# EAGLE design SparkFun_Differential_I2C_Breakout_PCA9615_Qwiic (EAGLE 7.7.0)
ABBREV: hb1; PROJECT: Heading Board
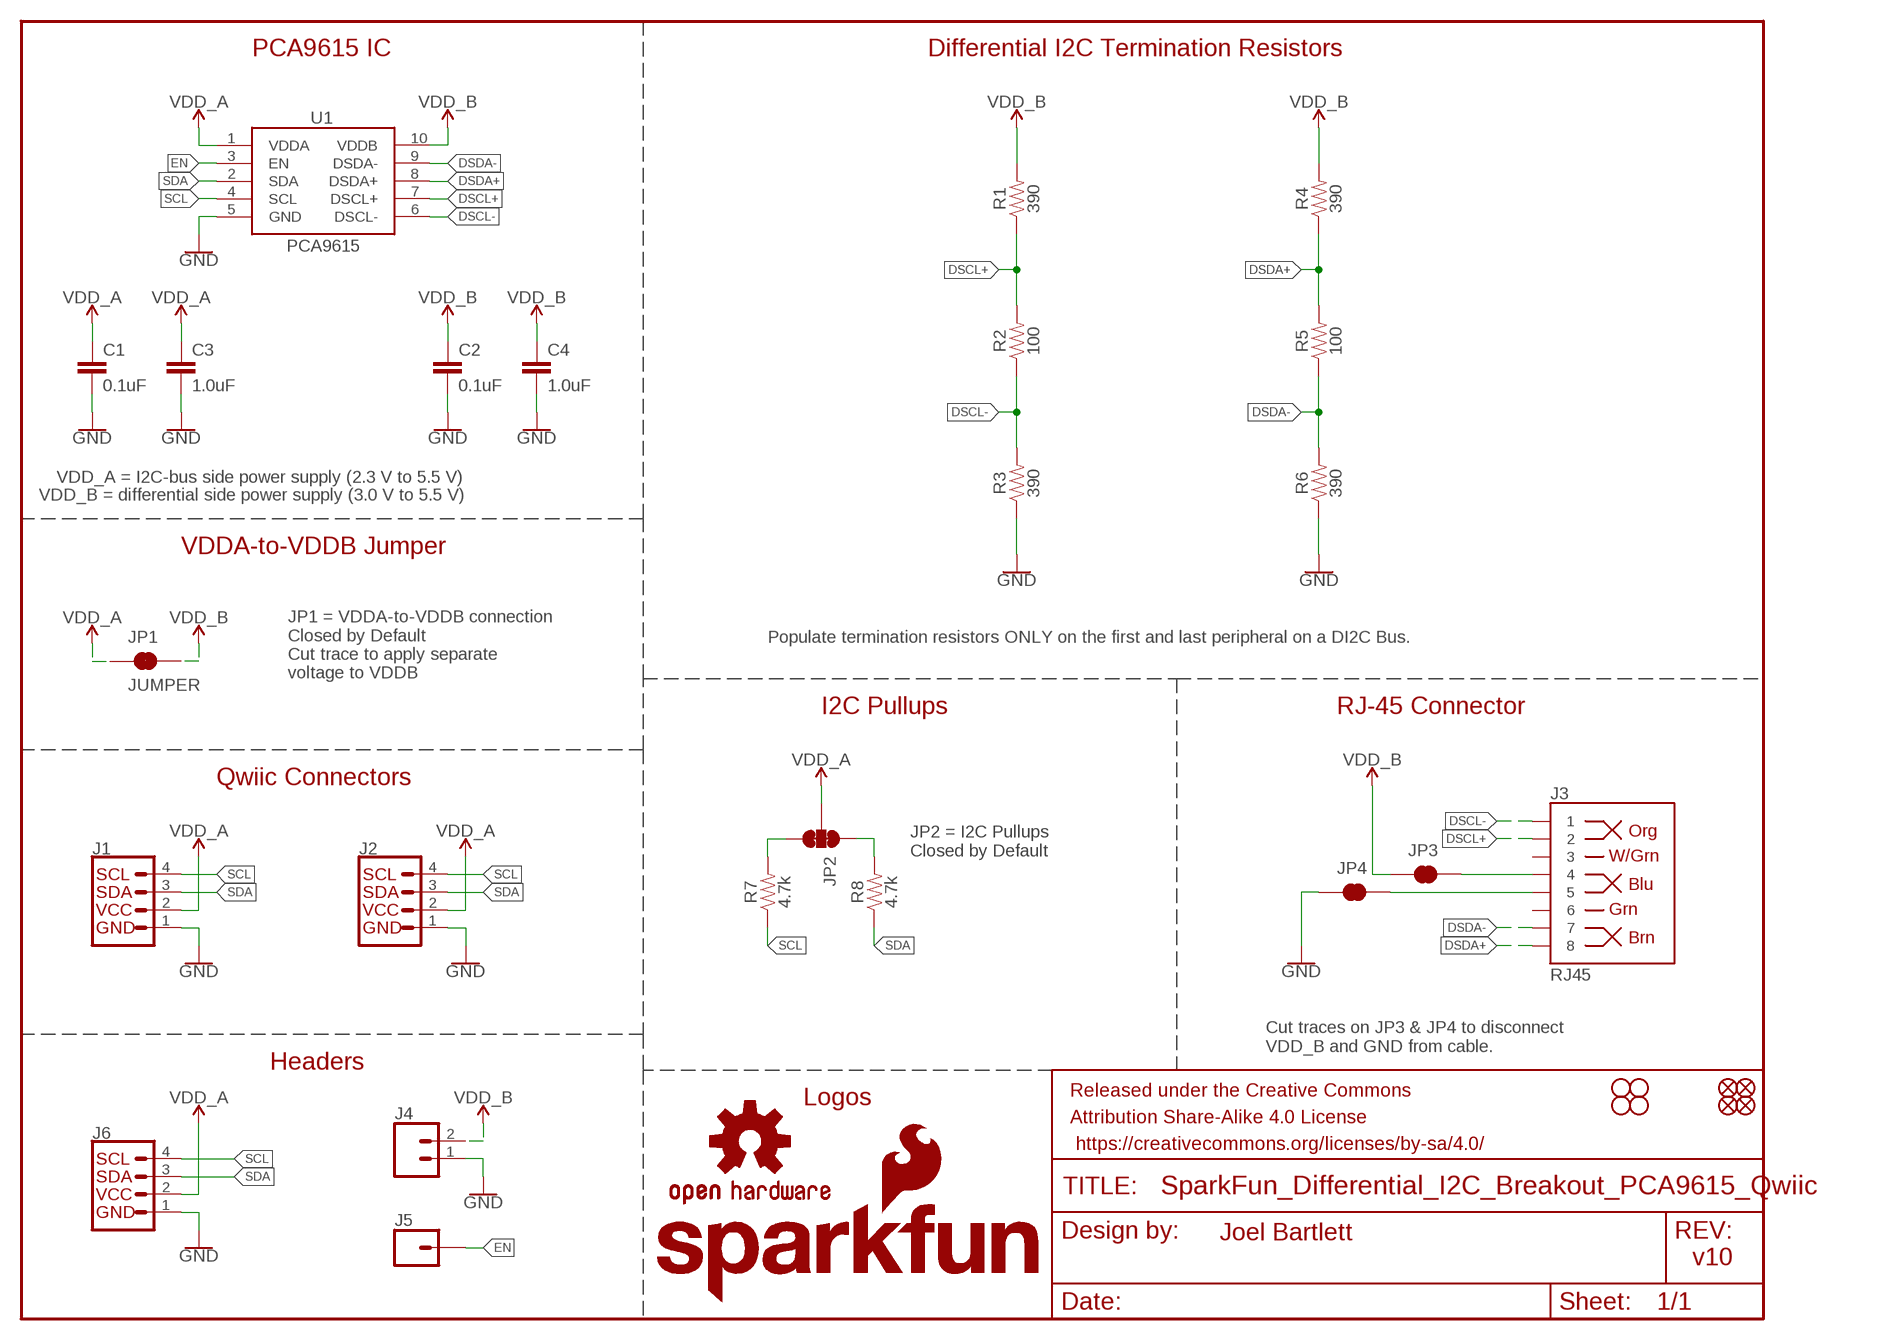
[diagram p0: schematic, sheet 1]

## Parts
C1  0.1uF  0.1UF-0603-25V-(+80/-20%)  [0603]
C2  0.1uF  0.1UF-0603-25V-(+80/-20%)  [0603]
C3  1.0uF  1.0UF-0603-16V-10%  [0603]
C4  1.0uF  1.0UF-0603-16V-10%  [0603]
FD1  FIDUCIALUFIDUCIAL  [FIDUCIAL-MICRO]
FD2  FIDUCIALUFIDUCIAL  [FIDUCIAL-MICRO]
FD3  FIDUCIALUFIDUCIAL  [FIDUCIAL-MICRO]
FD4  FIDUCIALUFIDUCIAL  [FIDUCIAL-MICRO]
FRAME1  FRAME-LETTER  [CREATIVE_COMMONS]
H1  STAND-OFF  [STAND-OFF]
H2  STAND-OFF  [STAND-OFF]
H3  STAND-OFF  [STAND-OFF]
H4  STAND-OFF  [STAND-OFF]
J1  QWIIC_CONNECTORJS-1MM  [1X04_1MM_RA]
J2  QWIIC_CONNECTORJS-1MM  [1X04_1MM_RA]
J3  RJ45  RJ45-8  [RJ45-8]
J4  CONN_021X02_NO_SILK  [1X02_NO_SILK]
J5  CONN_01PTH_NO_SILK_YES_STOP  [1X01_NO_SILK]
J6  I2C_STANDARD_NO_SILK  [1X04_NO_SILK]
JP1  JUMPER  JUMPER-SMT_2_NC_TRACE_SILK  [SMT-JUMPER_2_NC_TRACE_SILK]
JP2  JUMPER-SMT_3_2-NC_TRACE_SILK  [SMT-JUMPER_3_2-NC_TRACE_SILK]
JP3  JUMPER-SMT_2_NC_TRACE_SILK  [SMT-JUMPER_2_NC_TRACE_SILK]
JP4  JUMPER-SMT_2_NC_TRACE_SILK  [SMT-JUMPER_2_NC_TRACE_SILK]
LOGO1  OSHW-LOGOM  [OSHW-LOGO-M]
LOGO5  SFE_LOGO_NAME_FLAME.1_INCH  [SFE_LOGO_NAME_FLAME_.1]
R1  390  390OHM-0603-1/10W-1%  [0603]
R2  100  100OHM-0603-1/10W-1%  [0603]
R3  390  390OHM-0603-1/10W-1%  [0603]
R4  390  390OHM-0603-1/10W-1%  [0603]
R5  100  100OHM-0603-1/10W-1%  [0603]
R6  390  390OHM-0603-1/10W-1%  [0603]
R7  4.7k  4.7KOHM-0603-1/10W-1%  [0603]
R8  4.7k  4.7KOHM-0603-1/10W-1%  [0603]
U1  PCA9615  [TSSOP10]

## Nets
DSCL+: J3.2 R1.1 R2.2 U1.7(DSCL+)
DSCL-: J3.1 R2.1 R3.2 U1.6(DSCL-)
DSDA+: J3.8 R4.1 R5.2 U1.8(DSDA+)
DSDA-: J3.7 R5.1 R6.2 U1.9(DSDA-)
EN: J5.1 U1.3(EN)
GND: C1.2 C2.2 C3.2 C4.2 J1.1 J2.1 J4.1 J6.1(GND) JP4.1 R3.1 R6.1 U1.5(GND)
N$1: J3.4 JP3.2
N$2: J3.5 JP4.2
N$3: JP2.1 R8.2
N$4: JP2.3 R7.2
SCL: J1.4 J2.4 J6.4(SCL) R7.1 U1.4(SCL)
SDA: J1.3 J2.3 J6.3(SDA) R8.1 U1.2(SDA)
VDD_A: C1.1 C3.1 J1.2 J2.2 J6.2(VCC) JP1.1 JP2.2 U1.1(VDDA)
VDD_B: C2.1 C4.1 J4.2 JP1.2 JP3.1 R1.2 R4.2 U1.10(VDDB)
Unconnected: J3.3 J3.6

## Notes on the sheet
- PCA9615 IC | Differential I2C Termination Resistors
- VDD_A = I2C-bus side power supply (2.3 V to 5.5 V)
- VDD_B = differential side power supply (3.0 V to 5.5 V)
- VDDA-to-VDDB Jumper
- Populate termination resistors ONLY on the first and last peripheral on a DI2C Bus.
- JP1 = VDDA-to-VDDB connection
  Closed by Default
  Cut trace to apply separate 
  voltage to VDDB
- I2C Pullups | RJ-45 Connector
- Qwiic Connectors
- JP2 = I2C Pullups
  Closed by Default
- Cut traces on JP3 & JP4 to disconnect 
  VDD_B and GND from cable.
- Headers
- Logos
- Joel Bartlett
- v10

## Library data of the parts
C1 C2 = SparkFun-Capacitors:0.1UF: 0.1µF ceramic capacitors A capacitor is a passive two-terminal electrical component used to store electrical energy temporarily in an electric field.; PROD_ID: CAP-00810
C3 C4 = SparkFun-Capacitors:1.0UF: 1µF ceramic capacitors A capacitor is a passive two-terminal electrical component used to store electrical energy temporarily in an electric field.; PROD_ID: CAP-00868
FD1-FD4 = SparkFun-Aesthetics:FIDUCIAL: Fiducial Alignment Points Point-of-reference for pick-and-place machines and other optical instruments.
FRAME1 = SparkFun-Aesthetics:FRAME-LETTER: Schematic Frame - Letter Standard 8.5x11 US Letter frame
H1-H4 = SparkFun-Hardware:STAND-OFF: Stand Off Drill holes for mechanically mounting via screws, standoffs, etc. Note: Use the keepout ring to avoid running the screw head into surrounding components. Variant Overviews STAND-OFF - Mechanical footprint for a #4 phillips button head screw. STAND-OFF-TIGHT - Mechanical footprint for a #4 phillips button head screw, Example SparkFun Products Screw - Phillips Head (1/4", 4-40, 10 pack) <https://www.sparkfun.com/products/10453> (PRT-10453) Screw - Phillips Head (1/2", 4-40, 10 pack) <https://www.sparkfun.com/products/10452> (PRT-10452) Screw - Phillips Head (3/4", 4-40, 10 pack) <https://www.sparkfun.com/products/10451> (PRT-10451) Screw - Phillips Head (1", 4-40, 10 pack) <https://www.sparkfun.com/products/10450> (PRT-10450)
J1 J2 = SparkFun-Connectors:QWIIC_CONNECTOR: SparkFun I2C Standard Qwiic Connector An SMD 1mm pitch JST connector makes it easy and quick (get it? Qwiic?) to connect I2C devices to each other. The Qwiic system <http://www.sparkfun.com/qwiic> enables fast and solderless connection between popular platforms and various sensors and actuators. We carry 200mm <https://www.sparkfun.com/products/14204>, 100mm <https://www.sparkfun.com/products/14205>, 50mm <https://www.sparkfun.com/products/14206>, and breadboard friendly <https://www.sparkfun.com/products/14207> Qwiic cables. We also offer 10 pcs strips <https://www.sparkfun.com/products/14323> the SMD connectors.; PROD_ID: CONN-13694
J3 = SparkFun-Connectors:RJ45-8: RJ45 Jack - 8 pin Simple RJ45, 8-pin connection. Commonly used for Cat5, Cat5e, and Cat6 Ethernet cables. Here is the connector we sell at SparkFun: RJ45 8-Pin Connector <https://www.sparkfun.com/products/643> (PRT-00643) Datasheet <https://cdn.sparkfun.com/datasheets/Prototyping/04908.pdf> It is used on this SparkFun product: SparkFun RJ45 Breakout <https://www.sparkfun.com/products/716> (BOB-00716) Note, you may also be interested in the "MAGJACK" version of this. It is basically a RJ45 connector, but also has some status LEDs built into the connector housing. You can check that out in this library at the device named "MAGJACK.dev" and see these products online: RJ45 Ethernet MagJack-Compatible <https://www.sparkfun.com/products/8534> (PRT-08534) SparkFun RJ45 MagJack Breakout <https://www.sparkfun.com/products/13021> (BOB-13021); PROD_ID: CONN-08506; SF_ID: PRT-00643
J4 = SparkFun-Connectors:CONN_02: Multi connection point. Often used as Generic Header-pin footprint for 0.1 inch spaced/style header connections On any of the 0.1 inch spaced packages, you can populate with these: Break Away Headers - Straight <https://www.sparkfun.com/products/116> (PRT-00116) Break Away Male Headers - Right Angle <https://www.sparkfun.com/products/553> (PRT-00553) Female Headers <https://www.sparkfun.com/products/115> (PRT-00115) Break Away Headers - Machine Pin <https://www.sparkfun.com/products/117> (PRT-00117) Break Away Female Headers - Swiss Machine Pin <https://www.sparkfun.com/products/743> (PRT-00743) For SCREWTERMINALS and SPRING TERMINALS visit here: Screw Terimnals on SparkFun.com <https://www.sparkfun.com/search/results?term=Screw+Terminals> (5mm/3.5mm/2.54mm spacing) This device is also useful as a general connection point to wire up your design to another part of your project. Our various solder wires solder well into these plated through hole pads. Hook-Up Wire - Assortment (Stranded, 22 AWG) <https://www.sparkfun.com/products/11375> (PRT-11375) Hook-Up Wire - Assortment (Solid Core, 22 AWG) <https://www.sparkfun.com/products/11367> (PRT-11367) View the entire wire category on our website here <https://www.sparkfun.com/categories/141> Special notes: Molex polarized connector foot print use with: PRT-08233 with associated crimp pins and housings. 2.54_SCREWTERM for use with PRT-10571. 3.5mm Screw Terminal footprints for PRT-08084 5mm Screw Terminal footprints for use with PRT-08432
J5 = SparkFun-Connectors:CONN_01: Single connection point. Often used as Generic Header-pin footprint for 0.1 inch spaced/style header connections On any of the 0.1 inch spaced packages, you can populate with these: Break Away Headers - Straight <https://www.sparkfun.com/products/116> (PRT-00116) Break Away Male Headers - Right Angle <https://www.sparkfun.com/products/553> (PRT-00553) Female Headers <https://www.sparkfun.com/products/115> (PRT-00115) Break Away Headers - Machine Pin <https://www.sparkfun.com/products/117> (PRT-00117) Break Away Female Headers - Swiss Machine Pin <https://www.sparkfun.com/products/743> (PRT-00743) This device is also useful as a general connection point to wire up your design to another part of your project. Our various solder wires solder well into these plated through hole pads. Hook-Up Wire - Assortment (Stranded, 22 AWG) <https://www.sparkfun.com/products/11375> (PRT-11375) Hook-Up Wire - Assortment (Solid Core, 22 AWG) <https://www.sparkfun.com/products/11367> (PRT-11367) View the entire wire category on our website here <https://www.sparkfun.com/categories/141> Special notes: SMTSO-256-ET is a "flush mount" nut for a 4-40 screw. We mostly use this on specialty testbeds; it is a nice way to connect hardware to your PCB at an adjustable hieght. Also note, the SNAP packages are for using a snappable style connector. We sell a baggie of snaps and they are also used on two LilyPad designs: Snap Assortment - 30 pack (male and female) <https://www.sparkfun.com/products/11347> (DEV-11347) LilyPad Arduino SimpleSnap <https://www.sparkfun.com/products/10941> (DEV-10941) LilyPad SimpleSnap Protoboard <https://www.sparkfun.com/products/10940> (DEV-10940)
J6 = SparkX:I2C_STANDARD: SparkFun I2C Standard Pinout Header SparkFun has standardized on a pinout for all I2C based sensor breakouts. This pinout allows I2C boards to be plugged directly into the headers on Arduino Uno compatible boards, and to be daisy chained easily. Example SparkFun Products: SparkFun Atmospheric Sensor Breakout - BME280 <https://www.sparkfun.com/products/13676> SparkFun Altitude/Pressure Sensor Breakout - MPL3115A2 <https://www.sparkfun.com/products/11084> SparkFun TOF Range Finder Sensor - VL6180 <https://www.sparkfun.com/products/12785>
JP1 JP3 JP4 = SparkFun-Jumpers:JUMPER-SMT_2_NC_TRACE: Normally closed trace jumper This jumper has a trace between two pads so it's normally closed (NC). Use a razor knife to open the connection. For best results follow the IPC guidelines for cutting traces: Cutout at least 0.063 mm (0.005 in). Remove all loose material to clean up the cut area. Seal the cut with an approved epoxy. Reapply solder to reclose the connection.
JP2 = SparkFun-Jumpers:JUMPER-SMT_3_2-NC_TRACE: Normally closed trace jumper (2 of 2 connections) This jumper has a trace between all three pads so they are normally closed (NC). Use a razor knife to open the connection(s). For best results follow the IPC guidelines for cutting traces: Cutout at least 0.063 mm (0.005 in). Remove all loose material to clean up the cut area. Seal the cut with an approved epoxy. Reapply solder to reclose the connection(s).
LOGO1 = SparkFun-Aesthetics:OSHW-LOGO: Open-Source Hardware (OSHW) Logo This logo indicates the piece of hardware it is found on incorporates a OSHW license and/or adheres to the definition of open source hardware found here: http://freedomdefined.org/OSHW
LOGO5 = SparkFun-Aesthetics:SFE_LOGO_NAME_FLAME: SparkFun Font Logo w/ Flame This is the SparkFun full logo. The logo on the schematic will always be the same size; the package variant is the height of the flame part of the logo. Default layer for the logo on the board is tSilk.
R1 R3 R4 R6 = SparkFun-Resistors:390OHM: 390Ω resistor A resistor is a passive two-terminal electrical component that implements electrical resistance as a circuit element. Resistors act to reduce current flow, and, at the same time, act to lower voltage levels within circuits. - Wikipedia; PROD_ID: RES-07864
R2 R5 = SparkFun-Resistors:100OHM: 100Ω resistor A resistor is a passive two-terminal electrical component that implements electrical resistance as a circuit element. Resistors act to reduce current flow, and, at the same time, act to lower voltage levels within circuits. - Wikipedia; PROD_ID: RES-07863
R7 R8 = SparkFun-Resistors:4.7KOHM: 4.7kΩ resistor A resistor is a passive two-terminal electrical component that implements electrical resistance as a circuit element. Resistors act to reduce current flow, and, at the same time, act to lower voltage levels within circuits. - Wikipedia; PROD_ID: RES-07857
U1 = SparkFun-IC-Comms:PCA9615: Differential I2C Bus Buffer Datasheet <https://www.nxp.com/docs/en/data-sheet/PCA9615.pdf>; PROD_ID: IC-13899

## Net classes
0 default: width 0.203 mm
1 power: width 0.381 mm, clearance 0.254 mm

## Board
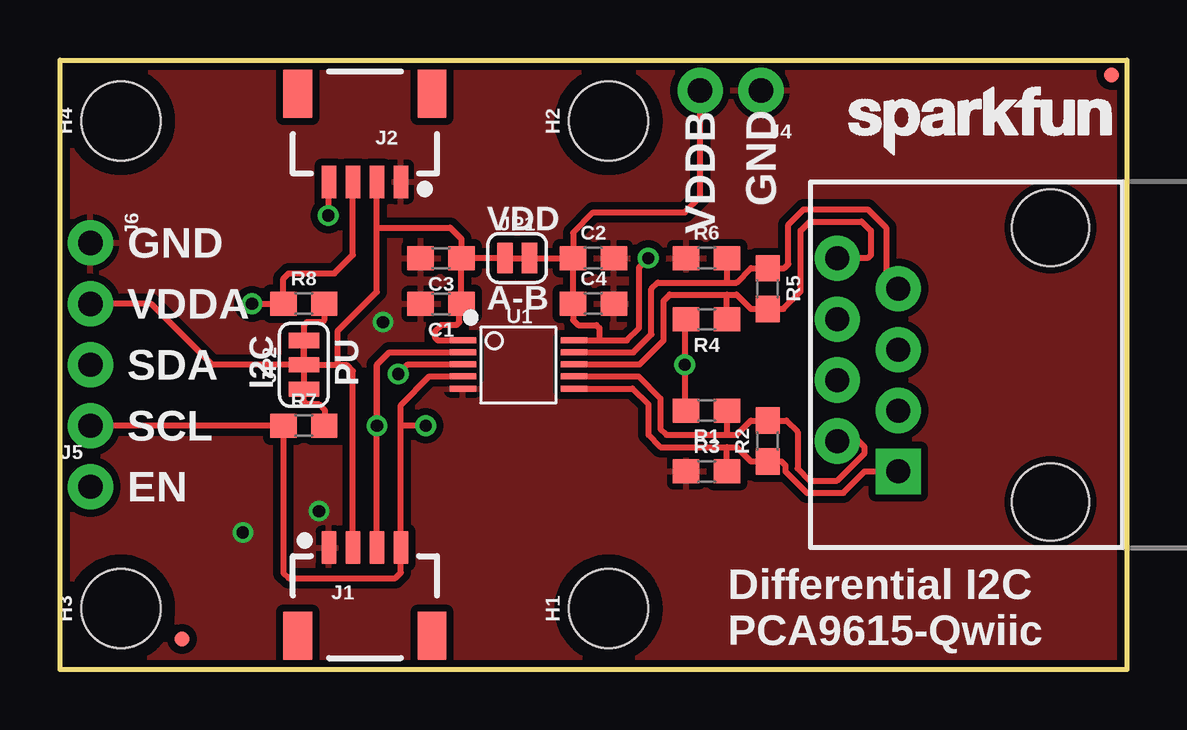
[diagram p1: board, top side]
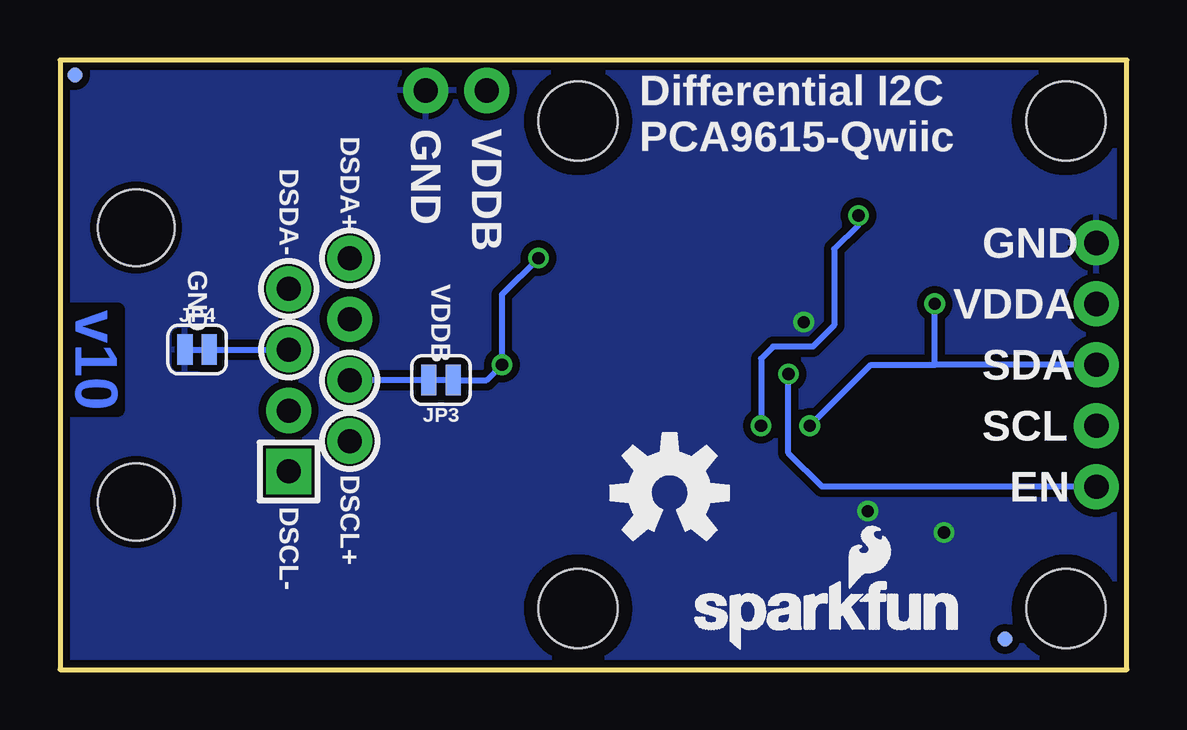
[diagram p2: board, bottom side, seen from below]

Size 44.45 x 25.4 mm. Coordinates in mm from the lower left corner, seen from the top.
Outline: 44.45,0 0,0 0,25.4 44.45,25.4 44.45,0
Copper layers (1*16): Top 0.035mm / dielectric 1.5mm / Bottom 0.035mm
Design rules "SparkFun-2-layer-TIGHT": minimum track width 7mil, minimum drill 15mil, track to track 7mil, track to pad 7mil, pad to pad 7mil, via to via 7mil, smd to smd 7mil, copper to edge 7mil, drill to drill 7mil, minimum pad ring 7mil, minimum via ring 7mil, stop-mask expansion 4mil, vias tented up to drill 25mil, thermal gap 10mil

### Footprints (pad centres in the part's own frame; a part is rotated, then mirrored left to right if it is on the bottom)
0603 = smd 1.1 x 1: 1 -0.85,0; 2 0.85,0
FIDUCIAL-MICRO = smd 0.635 x 0.635: 1 0,0
STAND-OFF = hole 3.302: 0,0
1X04_1MM_RA = smd 0.6 x 1.35: 1 -1.5,0; 2 -0.5,0; 3 0.5,0; 4 1.5,0 | smd 1.2 x 2: NC1 2.8,-3.675; NC2 -2.8,-3.675
RJ45-8 = drill 1 pad 1.88 square: 1 -4.445,6.35 | drill 1 pad 1.88: 2 -3.175,8.89; 3 -1.905,6.35; 4 -0.635,8.89; 5 0.635,6.35; 6 1.905,8.89; 7 3.175,6.35; 8 4.445,8.89 | hole 3.2: -5.715,0; 5.715,0
1X02_NO_SILK = drill 1.016 pad 1.88: 1 0,0; 2 2.54,0
1X01_NO_SILK = drill 1.016 pad 1.88: 1 0,0
1X04_NO_SILK = drill 1.016 pad 1.88: 1 0,0; 2 2.54,0; 3 5.08,0; 4 7.62,0
SMT-JUMPER_2_NC_TRACE_SILK = smd 0.635 x 1.27: 1 -0.508,0; 2 0.508,0
SMT-JUMPER_3_2-NC_TRACE_SILK = smd 0.635 x 1.27: 1 -1.016,0; 2 0,0; 3 1.016,0
TSSOP10 = smd 1.1 x 0.25: 1 -2.259,1.018; 2 -2.259,0.517; 3 -2.259,0.018; 4 -2.259,-0.482; 5 -2.259,-0.988; 6 2.366,-0.988; 7 2.366,-0.482; 8 2.366,0.018; 9 2.366,0.517; 10 2.366,1.018

### Placement (x,y rotation side)
C1  15.88,15.24 180 top
C2  22.23,17.14 0 top
C3  15.88,17.14 180 top
C4  22.23,15.24 0 top
FD1  5.08,1.27 0 top
FD2  43.81,24.77 0 top
FD3  5.08,1.27 0 bottom
FD4  43.81,24.77 0 bottom
FRAME1  -16.51,-8.89 0 top  (outside the outline)
H1  22.86,2.54 90 top
H2  22.86,22.86 90 top
H3  2.54,2.54 90 top
H4  2.54,22.86 90 top
J1  12.7,5.08 0 top
J2  12.7,20.32 180 top
J3  41.27,12.7 90 top
J4  29.21,24.13 180 top
J5  1.27,7.62 0 top
J6  1.27,17.78 270 top
JP1  19.05,17.14 0 top
JP2  10.16,12.7 90 top
JP3  28.57,12.06 180 bottom
JP4  38.73,13.34 0 bottom
LOGO1  19.05,7.37 0 bottom
LOGO3  SFE_LOGO_NAME.1_INCH  [SFE_LOGO_NAME_.1]  32.38,20.95 0 top
LOGO5  18.41,0.76 0 bottom
R1  26.94,10.79 180 top
R2  29.48,9.53 90 top
R3  26.94,8.26 0 top
R4  26.94,14.61 180 top
R5  29.48,15.88 270 top
R6  26.94,17.14 0 top
R7  10.16,10.16 0 top
R8  10.16,15.24 0 top
U1  19.05,12.7 0 top

### Tracks (layer width: path | path; a pad name or v marks a point on that pad's centre or on a via)
DSCL+
  Top 0.254: U1.7 24.11,12.22 25.02,11.3 25.02,10.03 25.27,9.78 27.79,9.78 | R1.1 27.79,9.78 | J3.2 33.27,9.53 33.53,9.27 33.53,9.02 32.38,7.87 31.24,7.87 30.73,8.38 30.73,9.91 30.27,10.38 R2.2 28.79,10.38 28.19,9.78 27.79,9.78
DSCL-
  Top 0.254: U1.6 23.85,11.71 24.51,11.05 24.51,9.78 25.02,9.27 27.79,9.27 | R3.2 27.79,9.27 | J3.1 33.53,8.26 32.64,7.37 31.11,7.37 30.23,8.26 30.23,8.51 30.06,8.68 R2.1 28.79,8.68 28.19,9.27 27.79,9.27
DSDA+
  Top 0.254: J3.8 33.66,17.14 33.78,17.27 33.78,18.29 33.4,18.67 31.24,18.67 30.86,18.29 30.86,15.75 30.14,15.03 R5.2 28.79,15.03 28.19,15.62 27.79,15.62 | U1.8 24.15,12.72 25.15,13.72 25.15,15.37 25.4,15.62 27.79,15.62 | R4.1 27.79,15.62
DSDA-
  Top 0.254: U1.9 23.89,13.22 24.64,13.97 24.64,15.86 24.91,16.13 27.79,16.13 | R6.2 27.79,16.13 | J3.7 34.42,16.38 34.42,18.41 33.66,19.18 30.99,19.18 30.35,18.54 30.35,16.89 30.19,16.73 R5.1 28.79,16.73 28.19,16.13 27.79,16.13
EN  (via drill 0.51)
  Top 0.254: U1.3 14.49,12.72 v14.1,12.32
  Bottom 0.254: J5.1 12.7,7.62 14.1,9.02 v14.1,12.32
GND  (via drill 0.51)
  Top 0.254: 16.51,11.71 U1.5
  other vias: 10.79,6.6 7.62,5.71 13.46,14.48
  pour Top (isolate 0.305): 44.45,0 0,0 0,25.4 44.45,25.4
  pour Bottom (isolate 0.305): 44.45,0 0,0 0,25.4 44.45,25.4
N$1
  Bottom 0.254: JP3.2 J3.4
N$2
  Bottom 0.254: JP4.2 J3.5
N$3
  Top 0.254: R8.2 11.01,14.57 10.92,14.48 10.29,14.48 10.16,14.35 10.16,12.7
N$4
  Top 0.254: R7.2 11.05,10.2 11.05,10.79 10.79,11.05 10.29,11.05 10.16,11.18 10.16,11.68
SCL  (via drill 0.51)
  Top 0.254: 14.2,10.16 J1.4 14.2,4.04 13.97,3.81 9.53,3.81 9.31,4.03 R7.1 J6.4 | 14.2,10.16 14.2,11.03 15.39,12.22 U1.4 | v15.24,10.16 14.2,10.16 | v11.18,18.92 11.2,18.95 J2.4
  Bottom 0.254: v15.24,10.16 15.24,12.95 14.73,13.46 13.08,13.46 12.19,14.35 12.19,17.53 11.18,18.54 v11.18,18.92
SDA  (via drill 0.51)
  Top 0.254: J1.3 arc-90 J1.3 13.2,12.69 13.21,12.7 | v8,15.24 R8.1 9.31,16.3 9.53,16.51 11.43,16.51 12.2,17.28 J2.3 | U1.2 13.73,13.22 13.21,12.7 | 13.21,12.7 v13.21,10.16
  Bottom 0.254: J6.3 8,12.7 | v13.21,10.16 10.67,12.7 8,12.7 | 8,12.7 v8,15.24
VDD_A
  Top 0.254: 11.56,12.7 11.94,12.7 12.2,12.44 J1.2 | 11.56,12.7 11.56,14.1 13.2,15.74 13.2,18.41 | JP1.1 18.54,17.4 18.29,17.14 C3.1 | U1.1 15.75,13.72 15.62,13.84 15.62,14.1 15.88,14.35 16.51,14.35 16.64,14.48 16.64,15.15 C1.1 C3.1 | 11.56,12.7 JP2.2 6.35,12.7 3.81,15.24 J6.2 | 13.2,18.41 J2.2 | 13.2,18.41 16.26,18.41 16.73,17.95 C3.1
VDD_B  (via drill 0.51)
  Top 0.254: JP1.2 19.56,17.4 19.81,17.14 C2.1 | U1.10 22.48,13.72 | 22.48,13.72 22.48,14.22 22.35,14.35 21.59,14.35 21.38,14.57 C4.1 C2.1 | 22.48,13.72 23.62,13.72 24.13,14.22 24.13,16.76 v24.51,17.14 | R1.2 26.04,10.85 v26.04,12.7 26.04,14.55 R4.2 | C2.1 21.38,18.2 22.23,19.05 26.04,19.05 26.67,19.68 J4.2
  Bottom 0.254: JP3.1 26.67,12.06 v26.04,12.7 26.04,15.62 v24.51,17.14

### Text on the board
Bottom: v10
tPlace: GND | VDD | VDDB | GND | VDDA | A-B | SDA | I2C | PU | SCL | EN | Differential I2C / PCA9615-Qwiic
bPlace: VDDB | GND | Differential I2C / PCA9615-Qwiic | DSDA+ | DSDA- | GND | GND | VDDB | VDDA | SDA | SCL | DSCL+ | EN | DSCL-
Measures: Measurements in mm
tDocu: Joel Bartlett